# Altium schematic sheet SCH_WINGLET_SOC.SchDoc: Winglet T113 SOC
size B; DrawnBy: HCAdam; Organization: Aerospace Village; DocumentNumber: WINGLET; Revision: A; SheetNumber: 3; SheetTotal: 10
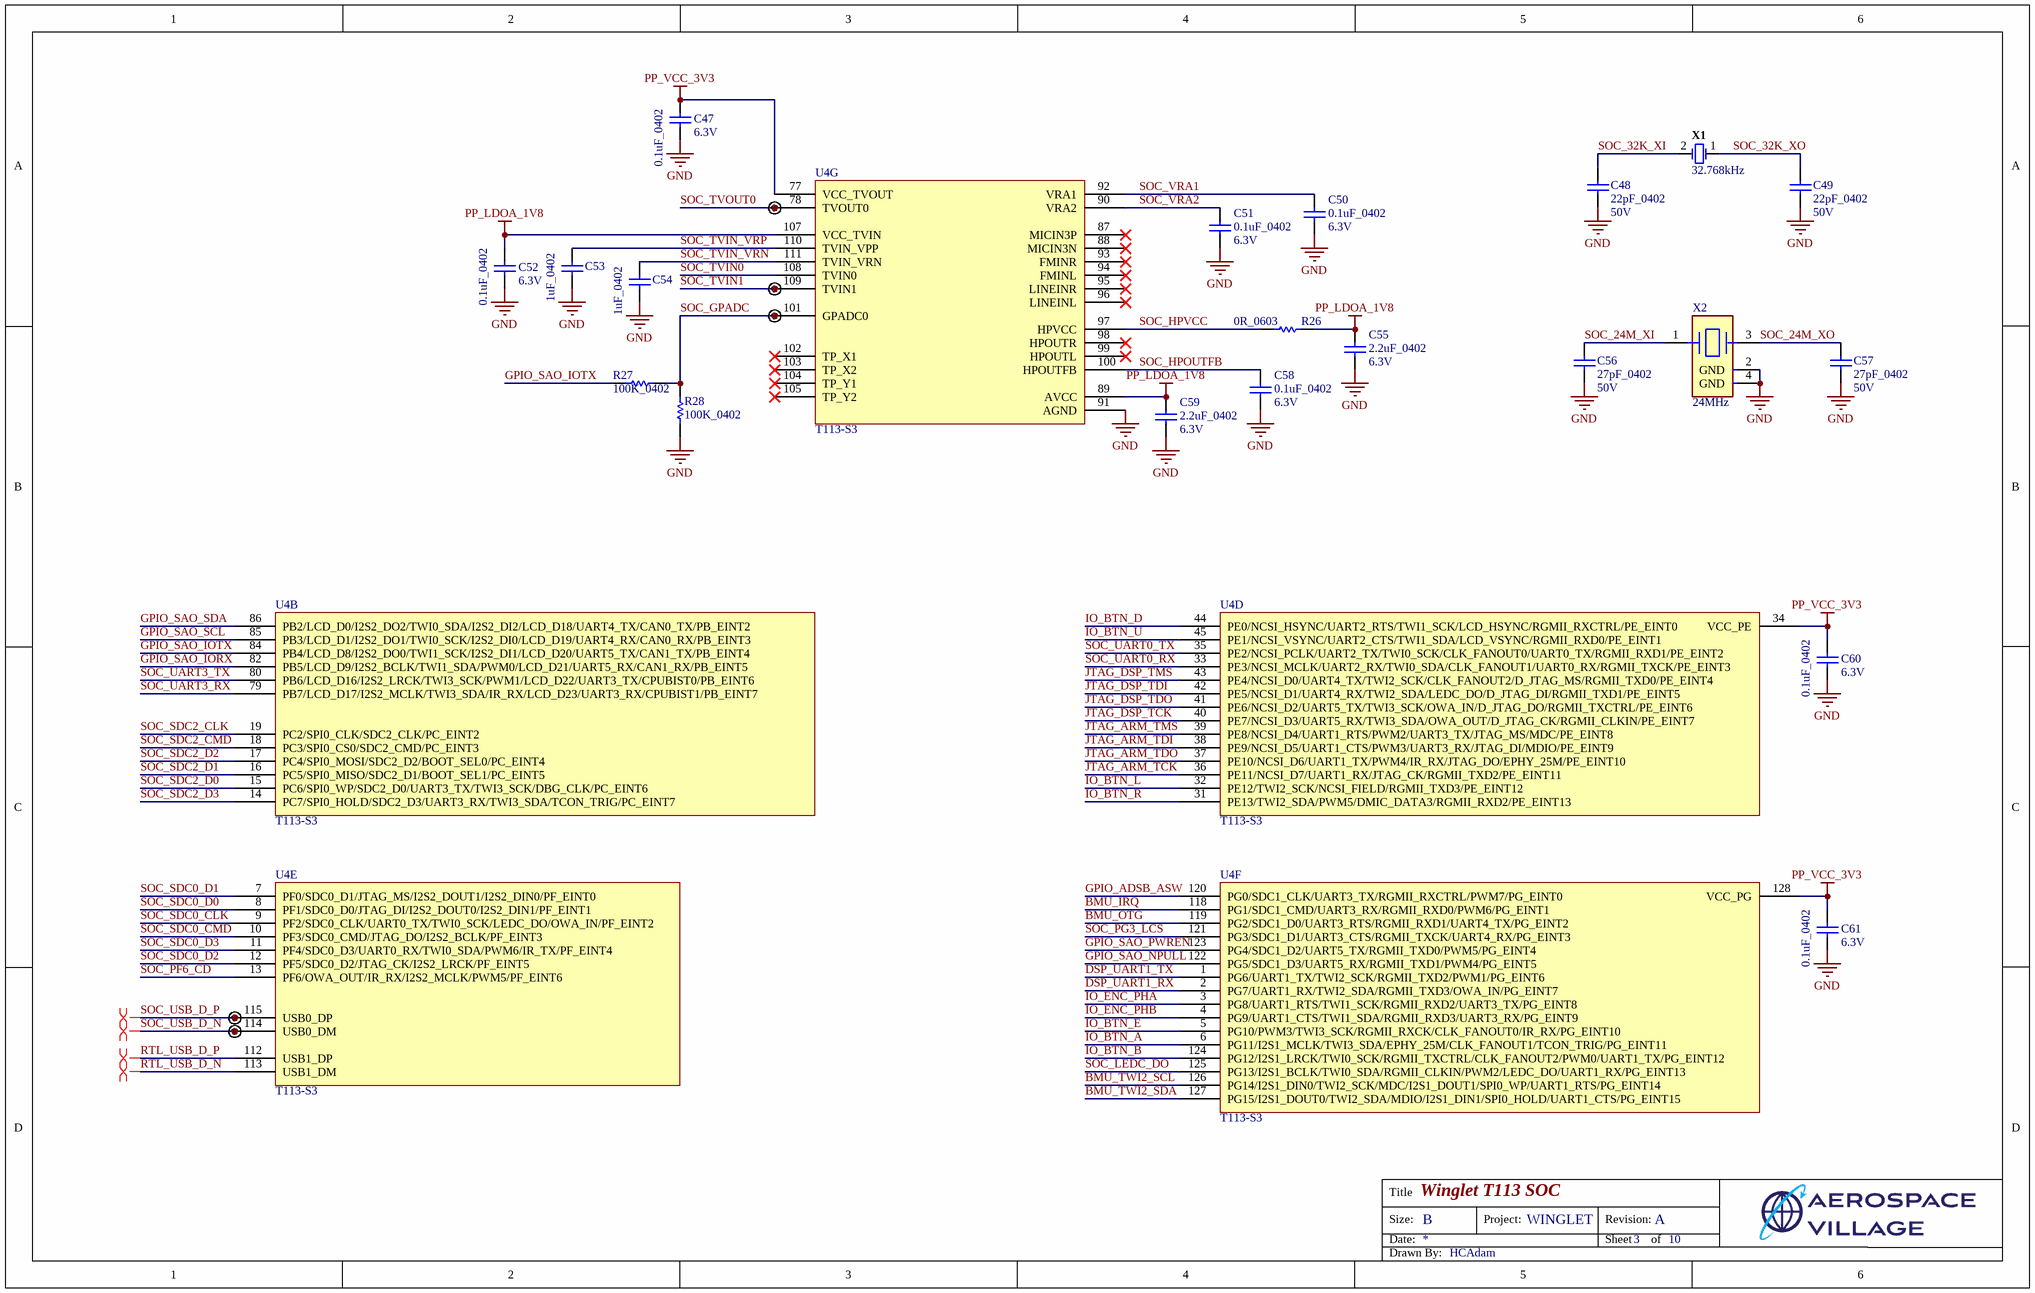
[diagram p0: SCH_WINGLET_SOC.SchDoc]

## Parts
C47  0.1uF_0402  Voltage Rating: 6.3V  [CAPC1005X56X25NL10T15]
C48  22pF_0402  Voltage Rating: 50V  [CAPC1005X56X25LL10T15]
C49  22pF_0402  Voltage Rating: 50V  [CAPC1005X56X25LL10T15]
C50  0.1uF_0402  Voltage Rating: 6.3V  [CAPC1005X56X25NL10T15]
C51  0.1uF_0402  Voltage Rating: 6.3V  [CAPC1005X56X25NL10T15]
C52  0.1uF_0402  Voltage Rating: 6.3V  [CAPC1005X56X25NL10T15]
C53  1uF_0402  [CAPC1005X55X25NL5T10]
C54  1uF_0402  [CAPC1005X55X25NL5T10]
C55  2.2uF_0402  Voltage Rating: 6.3V  [CAPC1005X55X25NL05T10]
C56  27pF_0402  Voltage Rating: 50V  [CAPC1005X55X25ML05T10]
C57  27pF_0402  Voltage Rating: 50V  [CAPC1005X55X25ML05T10]
C58  0.1uF_0402  Voltage Rating: 6.3V  [CAPC1005X56X25NL10T15]
C59  2.2uF_0402  Voltage Rating: 6.3V  [CAPC1005X55X25NL05T10]
C60  0.1uF_0402  Voltage Rating: 6.3V  [CAPC1005X56X25NL10T15]
C61  0.1uF_0402  Voltage Rating: 6.3V  [CAPC1005X56X25NL10T15]
R26  0R_0603  [RESC1608X55X25LL10T15]
R27  100K_0402  [RESC1005X40X25NL05T10]
R28  100K_0402  [RESC1005X40X25NL05T10]
TP7  TESTPOINT  [TESTPOINT-0.7MM-SINGLE-LAYER]  (value not drawn)  (no BOM)
TP8  TESTPOINT  [TESTPOINT-0.7MM-SINGLE-LAYER]  (value not drawn)  (no BOM)
TP9  TESTPOINT  [TESTPOINT-0.7MM-SINGLE-LAYER]  (value not drawn)  (no BOM)
TP10  TESTPOINT  [TESTPOINT-0.7MM-SINGLE-LAYER]  (value not drawn)  (no BOM)
TP11  TESTPOINT  [TESTPOINT-0.7MM-SINGLE-LAYER]  (value not drawn)  (no BOM)
U4  T113-S3  [TSQFP40P1600X1600X160_HS-129N]  (parts B,D,E,F,G of 7)
X1  32.768kHz  [ABRA-ABS07_A_V]
X2  24MHz  [FP-7M-MFG]

## Nets
GND: C47.1 C48.1 C49.1 C50.1 C51.1 C52.1 C53.1 C54.1 C55.1 C56.1 C57.1 C58.1 C59.1 C60.1 C61.1 R28.1 U4.91(AGND) X2.2(GND) X2.4(GND)
PP_LDOA_1V8: C52.2 C55.2 C59.2 R26.1 U4.89(AVCC) U4.107(VCC_TVIN)
PP_VCC_3V3: C47.2 C60.2 C61.2 U4.34(VCC_PE) U4.77(VCC_TVOUT) U4.128(VCC_PG)
BMU_IRQ: U4.118(PG1/SDC1_CMD/UART3_RX/RGMII_RXD0/PWM6/PG_EINT1)
BMU_OTG: U4.119(PG2/SDC1_D0/UART3_RTS/RGMII_RXD1/UART4_TX/PG_EINT2)
BMU_TWI2_SCL: U4.126(PG14/I2S1_DIN0/TWI2_SCK/MDC/I2S1_DOUT1/SPI0_WP/UART1_RTS/PG_EINT14)
BMU_TWI2_SDA: U4.127(PG15/I2S1_DOUT0/TWI2_SDA/MDIO/I2S1_DIN1/SPI0_HOLD/UART1_CTS/PG_EINT15)
DSP_UART1_RX: U4.2(PG7/UART1_RX/TWI2_SDA/RGMII_TXD3/OWA_IN/PG_EINT7)
DSP_UART1_TX: U4.1(PG6/UART1_TX/TWI2_SCK/RGMII_TXD2/PWM1/PG_EINT6)
GPIO_ADSB_ASW: U4.120(PG0/SDC1_CLK/UART3_TX/RGMII_RXCTRL/PWM7/PG_EINT0)
GPIO_SAO_IORX: U4.82(PB5/LCD_D9/I2S2_BCLK/TWI1_SDA/PWM0/LCD_D21/UART5_RX/CAN1_RX/PB_EINT5)
GPIO_SAO_IOTX: R27.2 U4.84(PB4/LCD_D8/I2S2_DO0/TWI1_SCK/I2S2_DI1/LCD_D20/UART5_TX/CAN1_TX/PB_EINT4)
GPIO_SAO_NPULL: U4.122(PG5/SDC1_D3/UART5_RX/RGMII_TXD1/PWM4/PG_EINT5)
GPIO_SAO_PWREN: U4.123(PG4/SDC1_D2/UART5_TX/RGMII_TXD0/PWM5/PG_EINT4)
GPIO_SAO_SCL: U4.85(PB3/LCD_D1/I2S2_DO1/TWI0_SCK/I2S2_DI0/LCD_D19/UART4_RX/CAN0_RX/PB_EINT3)
GPIO_SAO_SDA: U4.86(PB2/LCD_D0/I2S2_DO2/TWI0_SDA/I2S2_DI2/LCD_D18/UART4_TX/CAN0_TX/PB_EINT2)
IO_BTN_A: U4.6(PG11/I2S1_MCLK/TWI3_SDA/EPHY_25M/CLK_FANOUT1/TCON_TRIG/PG_EINT11)
IO_BTN_B: U4.124(PG12/I2S1_LRCK/TWI0_SCK/RGMII_TXCTRL/CLK_FANOUT2/PWM0/UART1_TX/PG_EINT12)
IO_BTN_D: U4.44(PE0/NCSI_HSYNC/UART2_RTS/TWI1_SCK/LCD_HSYNC/RGMII_RXCTRL/PE_EINT0)
IO_BTN_E: U4.5(PG10/PWM3/TWI3_SCK/RGMII_RXCK/CLK_FANOUT0/IR_RX/PG_EINT10)
IO_BTN_L: U4.32(PE12/TWI2_SCK/NCSI_FIELD/RGMII_TXD3/PE_EINT12)
IO_BTN_R: U4.31(PE13/TWI2_SDA/PWM5/DMIC_DATA3/RGMII_RXD2/PE_EINT13)
IO_BTN_U: U4.45(PE1/NCSI_VSYNC/UART2_CTS/TWI1_SDA/LCD_VSYNC/RGMII_RXD0/PE_EINT1)
IO_ENC_PHA: U4.3(PG8/UART1_RTS/TWI1_SCK/RGMII_RXD2/UART3_TX/PG_EINT8)
IO_ENC_PHB: U4.4(PG9/UART1_CTS/TWI1_SDA/RGMII_RXD3/UART3_RX/PG_EINT9)
JTAG_ARM_TCK: U4.36(PE11/NCSI_D7/UART1_RX/JTAG_CK/RGMII_TXD2/PE_EINT11)
JTAG_ARM_TDI: U4.38(PE9/NCSI_D5/UART1_CTS/PWM3/UART3_RX/JTAG_DI/MDIO/PE_EINT9)
JTAG_ARM_TDO: U4.37(PE10/NCSI_D6/UART1_TX/PWM4/IR_RX/JTAG_DO/EPHY_25M/PE_EINT10)
JTAG_ARM_TMS: U4.39(PE8/NCSI_D4/UART1_RTS/PWM2/UART3_TX/JTAG_MS/MDC/PE_EINT8)
JTAG_DSP_TCK: U4.40(PE7/NCSI_D3/UART5_RX/TWI3_SDA/OWA_OUT/D_JTAG_CK/RGMII_CLKIN/PE_EINT7)
JTAG_DSP_TDI: U4.42(PE5/NCSI_D1/UART4_RX/TWI2_SDA/LEDC_DO/D_JTAG_DI/RGMII_TXD1/PE_EINT5)
JTAG_DSP_TDO: U4.41(PE6/NCSI_D2/UART5_TX/TWI3_SCK/OWA_IN/D_JTAG_DO/RGMII_TXCTRL/PE_EINT6)
JTAG_DSP_TMS: U4.43(PE4/NCSI_D0/UART4_TX/TWI2_SCK/CLK_FANOUT2/D_JTAG_MS/RGMII_TXD0/PE_EINT4)
RTL_USB_D_N: U4.113(USB1_DM)
RTL_USB_D_P: U4.112(USB1_DP)
SOC_24M_XI: C56.2 X2.1
SOC_24M_XO: C57.2 X2.3
SOC_32K_XI: C48.2 X1.2
SOC_32K_XO: C49.2 X1.1
SOC_GPADC: R27.1 R28.2 TP9.1 U4.101(GPADC0)
SOC_HPOUTFB: C58.2 U4.100(HPOUTFB)
SOC_HPVCC: R26.2 U4.97(HPVCC)
SOC_LEDC_DO: U4.125(PG13/I2S1_BCLK/TWI0_SDA/RGMII_CLKIN/PWM2/LEDC_DO/UART1_RX/PG_EINT13)
SOC_PF6_CD: U4.13(PF6/OWA_OUT/IR_RX/I2S2_MCLK/PWM5/PF_EINT6)
SOC_PG3_LCS: U4.121(PG3/SDC1_D1/UART3_CTS/RGMII_TXCK/UART4_RX/PG_EINT3)
SOC_SDC0_CLK: U4.9(PF2/SDC0_CLK/UART0_TX/TWI0_SCK/LEDC_DO/OWA_IN/PF_EINT2)
SOC_SDC0_CMD: U4.10(PF3/SDC0_CMD/JTAG_DO/I2S2_BCLK/PF_EINT3)
SOC_SDC0_D0: U4.8(PF1/SDC0_D0/JTAG_DI/I2S2_DOUT0/I2S2_DIN1/PF_EINT1)
SOC_SDC0_D1: U4.7(PF0/SDC0_D1/JTAG_MS/I2S2_DOUT1/I2S2_DIN0/PF_EINT0)
SOC_SDC0_D2: U4.12(PF5/SDC0_D2/JTAG_CK/I2S2_LRCK/PF_EINT5)
SOC_SDC0_D3: U4.11(PF4/SDC0_D3/UART0_RX/TWI0_SDA/PWM6/IR_TX/PF_EINT4)
SOC_SDC2_CLK: U4.19(PC2/SPI0_CLK/SDC2_CLK/PC_EINT2)
SOC_SDC2_CMD: U4.18(PC3/SPI0_CS0/SDC2_CMD/PC_EINT3)
SOC_SDC2_D0: U4.15(PC6/SPI0_WP/SDC2_D0/UART3_TX/TWI3_SCK/DBG_CLK/PC_EINT6)
SOC_SDC2_D1: U4.16(PC5/SPI0_MISO/SDC2_D1/BOOT_SEL1/PC_EINT5)
SOC_SDC2_D2: U4.17(PC4/SPI0_MOSI/SDC2_D2/BOOT_SEL0/PC_EINT4)
SOC_SDC2_D3: U4.14(PC7/SPI0_HOLD/SDC2_D3/UART3_RX/TWI3_SDA/TCON_TRIG/PC_EINT7)
SOC_TVIN0: U4.108(TVIN0)
SOC_TVIN1: TP8.1 U4.109(TVIN1)
SOC_TVIN_VRN: C54.2 U4.111(TVIN_VRN)
SOC_TVIN_VRP: C53.2 U4.110(TVIN_VPP)
SOC_TVOUT0: TP7.1 U4.78(TVOUT0)
SOC_UART0_RX: U4.33(PE3/NCSI_MCLK/UART2_RX/TWI0_SDA/CLK_FANOUT1/UART0_RX/RGMII_TXCK/PE_EINT3)
SOC_UART0_TX: U4.35(PE2/NCSI_PCLK/UART2_TX/TWI0_SCK/CLK_FANOUT0/UART0_TX/RGMII_RXD1/PE_EINT2)
SOC_UART3_RX: U4.79(PB7/LCD_D17/I2S2_MCLK/TWI3_SDA/IR_RX/LCD_D23/UART3_RX/CPUBIST1/PB_EINT7)
SOC_UART3_TX: U4.80(PB6/LCD_D16/I2S2_LRCK/TWI3_SCK/PWM1/LCD_D22/UART3_TX/CPUBIST0/PB_EINT6)
SOC_USB_D_N: TP11.1 U4.114(USB0_DM)
SOC_USB_D_P: TP10.1 U4.115(USB0_DP)
SOC_VRA1: C50.2 U4.92(VRA1)
SOC_VRA2: C51.2 U4.90(VRA2)

Not connected (* = marked no-connect by the designer): U4 87(MICIN3P)* 88(MICIN3N)* 93(FMINR)* 94(FMINL)* 95(LINEINR)* 96(LINEINL)* 98(HPOUTR)* 99(HPOUTL)* 102(TP_X1)* 103(TP_X2)* 104(TP_Y1)* 105(TP_Y2)*

## Layout directives
differential pair: RTL_USB_D_N, RTL_USB_D_P, SOC_USB_D_N, SOC_USB_D_P

## Notes on the sheet
- Title
- Size:
- Date:
- B
- Project:
- Revision:
- Sheet
- of
- Drawn By:

## Library data of the parts
C47 C50-C52 C58 C60 C61 = CMP-2008-02743-1: 04026D104KAT2A; Manufacturer: AVX Interconnect / Elco; Part Number: 04026D104KAT2A
C48 C49 = CMP-2008-02613-1: 04025A220JAT2A; Manufacturer: AVX Interconnect / Elco; Part Number: 04025A220JAT2A
C53 C54 = CMP-1662-00020-1: Chip Capacitor, 1 uF, +/- 10%, 6.3 V, -55 to 85 degC, 0402 (1005 Metric), RoHS, Tape and Reel / GRM155R60J105KE19D; Voltage Rating (DC): 3 V; Type (Capacitors): X5R; Voltage Rating: 6.3 V; Capacitance: 1 uF; ComponentLink2Description: Datasheet; ComponentLink2URL: http://psearch.en.murata.com/capacitor/product/GRM155R60J105KE19%23.pdf; Max Operating Temperature: 85 degC; Min Operating Temperature: -55 degC; Package Quantity: 10000; Mounting Technology: Surface Mount; ComponentLink1Description: Manufacturer URL; ComponentLink1URL: http://www.murata.com/; PackageDescription: 2-Pin Surface Mount Device, Body 1 x 0.5 mm; Tolerance: 10%; Case/Package: 0402; Mount: Surface Mount; Packaging: Tape and Reel; Case Code (Metric): 1005; Radiation Hardening: No; Width: 0.5 mm; Length: 1 mm; DatasheetVersion: 08/2016; Height: 0.5 mm; PartNumber: GRM155R60J105KE19D; RoHSCompliant: true; Case Code (Imperial): 0402; REACH SVHC: No SVHC; Pins: 2
C55 C59 = CMP-2008-04543-1: GRM155R60J225ME15D; Manufacturer: Murata; Part Number: GRM155R60J225ME15D
C56 C57 = CMP-2008-03917-1: GRM1555C1H270JA01D; Manufacturer: Murata; Part Number: GRM1555C1H270JA01D
R26 = CMP-2000-04300-1: RC0603JR-100RL; Manufacturer: Yageo; Part Number: RC0603JR-100RL
R27 R28 = CMP-2002-07343-1: RC0402FR-07100KL; Manufacturer: Yageo / Phycomp; Part Number: RC0402FR-07100KL
TP7-TP11 = TP_07: TESTPOINT SINGLE LAYER 0.7MM; AEC-Q: Yes; PPAP: Unknown; Selective Soldering: No; Value: Unknown; RoHS: Yes; Package: BOARD_FEATURE; Washable: Yes; Mounting: Unknown
U4 = T113-S3: Allwinner Dual-core ARM Cortex-A7 Smart Control and Display SoC
X1 = CMP-2000-07587-1: Tuning Fork Crystal, 32.768 KHz, +/- 20 ppm, -40 to 85 degC, 2-Pin SMD, RoHS, Tape and Reel, PN ABS07-120-32.768KHZ-T; Manufacturer: Abracon; Case\/Package: SMD/SMT; Series Resistance: 60KOhm; Frequency Tolerance: 20ppm; Load Capacitance: 6pF; ESR (Equivalent Series Resistance): 55KOhm; Max Operating Temperature: 85degC; Width: 0.061inch; Radiation Hardening: No; Lead Free: LeadFree; RoHSCompliant: True; Depth: 1.5mm; Datasheet URL: http://www.abracon.com/Resonators/ABS07-120-32.768kHz-T.pdf; Frequency: 32.768KHz; Termination: SMD/SMT; Manufacturer URL: http://www.abracon.com/; Package Quantity: 3000; Packaging: TapeandReel; Number of Pins: 2; Height: 0.035inch; Package Description: 2-Pin Surface Mount Device, Body 3.2 x 1.5 mm; Package Reference: ABS07; Mount: SurfaceMount; Tolerance: 20ppm; Mounting Technology: SurfaceMount; REACH SVHC: NoSVHC; Datasheet Version: 11/2014; Length: 3.2mm; Min Operating Temperature: -40degC
X2 = CMP-18717-000454-1: Crystal 24MHz, 30ppm, 12pF, 50Ω / 7M-24.000MAAE-T; ESR (Equivalent Series Resistance): 60R; Length: 0.126inch; Frequency Stability: 30ppm; Series: 7M; Max Operating Temperature: 70°C; Load Capacitance: 12pF; Width: 0.098inch; Frequency Tolerance: 30ppm; Min Operating Temperature: -20°C; Mount: Surface Mount; Package Quantity: 3000; REACH SVHC: No SVHC; Case/Package: SMD/SMT; Depth: 2.5mm; Height: 0.031inch; Frequency: 24MHz; Packaging: Tape and Reel; Number of Pins: 4